# EAGLE schematic arm (EAGLE 7.2.0)
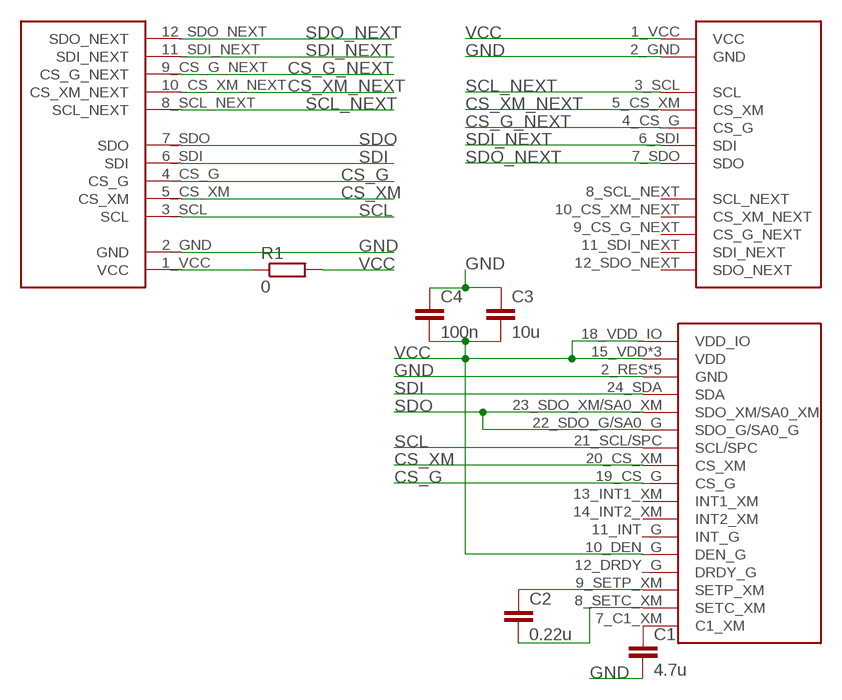
[diagram p0: schematic, sheet 1]

## Parts
C1  4.7u  C-EUC0805  [C0805]
C2  0.22u  C-EUC0805  [C0805]
C3  10u  C-EUC0805  [C0805]
C4  100n  C-EUC0603  [C0603]
IMU_IN  IMU-BUCHSE-IN  [IN]
IMU_OUT  IMU-BUCHSE-OUT  [OUT]
R1  0  R-EU_R0402  [R0402]
U$1  LSM9DS0-LGA-24  [LGA-24]

## Nets
CS_G: IMU_IN.4_CS_G(CS_G) U$1.19_CS_G(CS_G)
CS_G_NEXT: IMU_IN.9_CS_G_NEXT(CS_G_NEXT) IMU_OUT.4_CS_G(CS_G)
CS_XM: IMU_IN.5_CS_XM(CS_XM) U$1.20_CS_XM(CS_XM)
CS_XM_NEXT: IMU_IN.10_CS_XM_NEXT(CS_XM_NEXT) IMU_OUT.5_CS_XM(CS_XM)
GND: C1.2 C3.1 C4.1 IMU_IN.2_GND(GND) IMU_OUT.2_GND(GND) U$1.2_RES(GND) U$1.3_RES(GND) U$1.4_RES(GND) U$1.5_GND(GND) U$1.6_GND(GND)
N$1: C1.1 U$1.7_C1_XM(C1_XM)
N$2: C2.1 U$1.9_SETP_XM(SETP_XM)
N$3: C2.2 U$1.8_SETC_XM(SETC_XM)
N$4: IMU_IN.1_VCC(VCC) R1.1
SCL: IMU_IN.3_SCL(SCL) U$1.21_SCL/SPC(SCL/SPC)
SCL_NEXT: IMU_IN.8_SCL_NEXT(SCL_NEXT) IMU_OUT.3_SCL(SCL)
SDI: IMU_IN.6_SDI(SDI) U$1.24_SDA(SDA)
SDI_NEXT: IMU_IN.11_SDI_NEXT(SDI_NEXT) IMU_OUT.6_SDI(SDI)
SDO: IMU_IN.7_SDO(SDO) U$1.22_SDO_G/SA0_G(SDO_G/SA0_G) U$1.23_SDO_XM/SA0_XM(SDO_XM/SA0_XM)
SDO_NEXT: IMU_IN.12_SDO_NEXT(SDO_NEXT) IMU_OUT.7_SDO(SDO)
VCC: C3.2 C4.2 IMU_OUT.1_VCC(VCC) R1.2 U$1.10_DEN_G(DEN_G) U$1.15_VDD(VDD) U$1.16_VDD(VDD) U$1.17_VDD(VDD) U$1.18_VDD_IO(VDD_IO)
Unconnected: IMU_OUT.8_SCL_NEXT(SCL_NEXT) IMU_OUT.9_CS_G_NEXT(CS_G_NEXT) IMU_OUT.10_CS_XM_NEXT(CS_XM_NEXT) IMU_OUT.11_SDI_NEXT(SDI_NEXT) IMU_OUT.12_SDO_NEXT(SDO_NEXT) U$1.11_INT_G(INT_G) U$1.12_DRDY_G(DRDY_G) U$1.13_INT1_XM(INT1_XM) U$1.14_INT2_XM(INT2_XM)

## Library data of the parts
C1-C3 = rclGlove:C-EU: CAPACITOR, European symbol
C4 = resistor:C-EU: CAPACITOR, European symbol
IMU_IN = IMU-Buchse:IMU-BUCHSE-IN
IMU_OUT = IMU-Buchse:IMU-BUCHSE-OUT
R1 = rclGlove:R-EU_: RESISTOR, European symbol
U$1 = ST LSM9DS0TR:LSM9DS0-LGA-24